# Altium schematic sheet bldc-driver.SchDoc
size A3
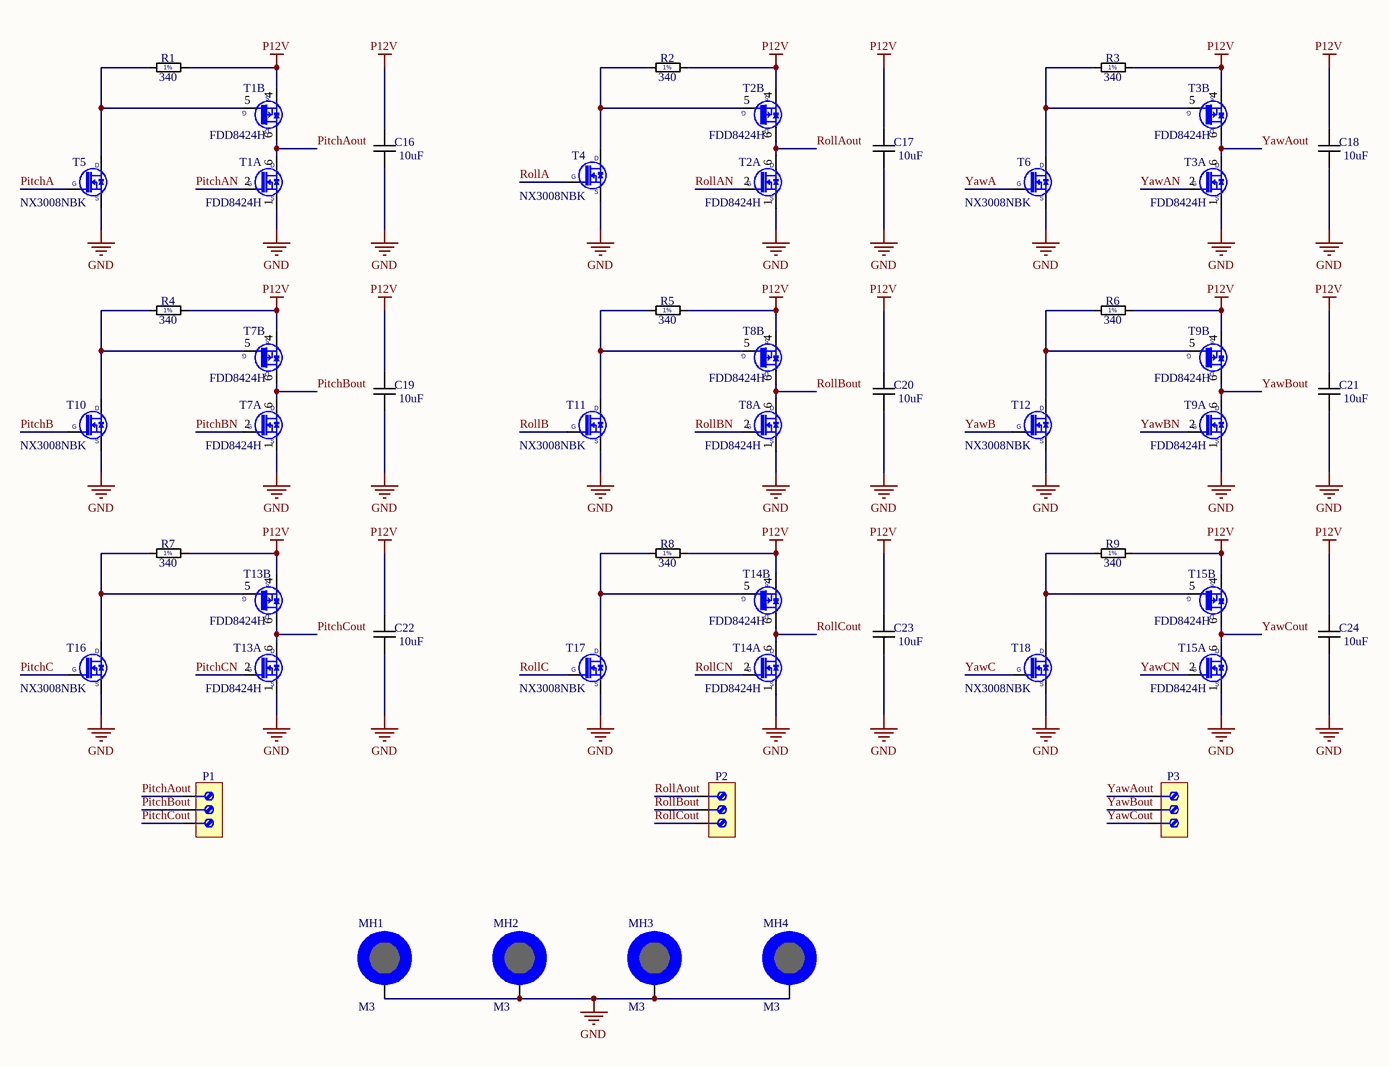
[diagram p0: bldc-driver.SchDoc]

## Parts
C16  10uF  [CAPC0603X90N]
C17  10uF  [CAPC0603X90N]
C18  10uF  [CAPC0603X90N]
C19  10uF  [CAPC0603X90N]
C20  10uF  [CAPC0603X90N]
C21  10uF  [CAPC0603X90N]
C22  10uF  [CAPC0603X90N]
C23  10uF  [CAPC0603X90N]
C24  10uF  [CAPC0603X90N]
MH1  M3  [MH-M3_COPPER]  (no BOM)
MH2  M3  [MH-M3_COPPER]  (no BOM)
MH3  M3  [MH-M3_COPPER]  (no BOM)
MH4  M3  [MH-M3_COPPER]  (no BOM)
P1  AK100/..DS-5.0-V-GREY  [SCREWERM_THT_3X1H_5P08MM]  (value not drawn)
P2  AK100/..DS-5.0-V-GREY  [SCREWERM_THT_3X1H_5P08MM]  (value not drawn)
P3  AK100/..DS-5.0-V-GREY  [SCREWERM_THT_3X1H_5P08MM]  (value not drawn)
R1  340  [RESC0402X40N]
R2  340  [RESC0402X40N]
R3  340  [RESC0402X40N]
R4  340  [RESC0402X40N]
R5  340  [RESC0402X40N]
R6  340  [RESC0402X40N]
R7  340  [RESC0402X40N]
R8  340  [RESC0402X40N]
R9  340  [RESC0402X40N]
T1  FDD8424H  [TO252 - 4L]  (parts A,B of 2)
T2  FDD8424H  [TO252 - 4L]  (parts A,B of 2)
T3  FDD8424H  [TO252 - 4L]  (parts A,B of 2)
T4  NX3008NBK  [SOT23-3]
T5  NX3008NBK  [SOT23-3]
T6  NX3008NBK  [SOT23-3]
T7  FDD8424H  [TO252 - 4L]  (parts A,B of 2)
T8  FDD8424H  [TO252 - 4L]  (parts A,B of 2)
T9  FDD8424H  [TO252 - 4L]  (parts A,B of 2)
T10  NX3008NBK  [SOT23-3]
T11  NX3008NBK  [SOT23-3]
T12  NX3008NBK  [SOT23-3]
T13  FDD8424H  [TO252 - 4L]  (parts A,B of 2)
T14  FDD8424H  [TO252 - 4L]  (parts A,B of 2)
T15  FDD8424H  [TO252 - 4L]  (parts A,B of 2)
T16  NX3008NBK  [SOT23-3]
T17  NX3008NBK  [SOT23-3]
T18  NX3008NBK  [SOT23-3]

## Nets
GND: C16.1 C17.1 C18.1 C19.1 C20.1 C21.1 C22.1 C23.1 C24.1 MH1.MH MH2.MH MH3.MH MH4.MH T1.1(S) T2.1(S) T3.1(S) T4.2(S) T5.2(S) T6.2(S) T7.1(S) T8.1(S) T9.1(S) T10.2(S) T11.2(S) T12.2(S) T13.1(S) T14.1(S) T15.1(S) T16.2(S) T17.2(S) T18.2(S)
P12V: C16.2 C17.2 C18.2 C19.2 C20.2 C21.2 C22.2 C23.2 C24.2 R1.2 R2.2 R3.2 R4.2 R5.2 R6.2 R7.2 R8.2 R9.2 T1.4(S) T2.4(S) T3.4(S) T7.4(S) T8.4(S) T9.4(S) T13.4(S) T14.4(S) T15.4(S)
PitchA: T5.1(G)
PitchAN: T1.2(G)
PitchAout: P1.1 T1.6(D)
PitchB: T10.1(G)
PitchBN: T7.2(G)
PitchBout: P1.2 T7.6(D)
PitchC: T16.1(G)
PitchCN: T13.2(G)
PitchCout: P1.3 T13.6(D)
RollA: T4.1(G)
RollAN: T2.2(G)
RollAout: P2.1 T2.6(D)
RollB: T11.1(G)
RollBN: T8.2(G)
RollBout: P2.2 T8.6(D)
RollC: T17.1(G)
RollCN: T14.2(G)
RollCout: P2.3 T14.6(D)
YawA: T6.1(G)
YawAN: T3.2(G)
YawAout: P3.1 T3.6(D)
YawB: T12.1(G)
YawBN: T9.2(G)
YawBout: P3.2 T9.6(D)
YawC: T18.1(G)
YawCN: T15.2(G)
YawCout: P3.3 T15.6(D)
NetR1_1: R1.1 T1.5(G) T5.3(D)
NetR2_1: R2.1 T2.5(G) T4.3(D)
NetR3_1: R3.1 T3.5(G) T6.3(D)
NetR4_1: R4.1 T7.5(G) T10.3(D)
NetR5_1: R5.1 T8.5(G) T11.3(D)
NetR6_1: R6.1 T9.5(G) T12.3(D)
NetR7_1: R7.1 T13.5(G) T16.3(D)
NetR8_1: R8.1 T14.5(G) T17.3(D)
NetR9_1: R9.1 T15.5(G) T18.3(D)

## Library data of the parts
C16-C24 = CC0603_10UF_16V_20%_X5R: Non-polarised capacitor; Manufacturer: GENERIC; Manufacturer 1 Example: Samsung; Manufacturer 1 Part Number: CL10A106MO8NQNC; Manufacturer 1 Component Height: 0.8mm; PressFit: No; Dielectric: X5R; Tolerance: 20%; Voltage: 16V; DesignItemId: CC0603_10UF_16V_20%_X5R; Author: KB; Case: 0603 (1608 metric); Component Kind: Standard; HelpURL: https://www.vishay.com/docs/28548/vjw1bcbascomseries.pdf; Manufacturer Part Number: CC0603_10UF_16V_20%_X5R; Mounted: Yes; Part Description: Non-polarised capacitor; Pin Count: 2; Sense: No; SMD: Yes; Socket: No; Status: Recommended; Value: 10uF; Supplier 1: Farnell; Supplier 2: TME; Supplier 3: Mouser; Create Date: 01.04.2019; LatestRevisionDate: 01.04.2019; Supplier Part Number 1: 2611923; Supplier Part Number 2: CL10A106MO8NQNC; Supplier Part Number 3: 81-GRM188R61C106KALD
MH1-MH4 = MH-M3_C: Mounting hole, M3, exposed pad; DesignItemId: MH-M3_C; Author: KB; Family: M3; Part Description: Mounting hole, M3, exposed pad; Create Date: 19.05.2011; LatestRevisionDate: 19.05.2011
P1-P3 = SCREWERM_THT_3X1H_5P08MM: Terminal Block, Right angle, 3 Positions, THT, Screw Connection, 15x9mm body; Manufacturer: GENERIC; Manufacturer Part Number: SCREWTERM_THT_3X1H_5P08MM; Manufacturer 1 Example: PTR Messtechnik; Manufacturer 1 Part Number: AK100/3DS-5,0-V/GRAU; Manufacturer 1 Component Height: 12.5mm; Current Max: 24A; PressFit: No; Voltage Max: 250V; DesignItemId: SCREWERM_THT_3X1H_5P08MM; Author: KB; Family: AK100/..DS-5.0-V-GREY; Component Kind: Standard; Footprint: SCREWTERM_THT_3X1H_5P08MM; HelpURL: https://www.ptr.eu/en/products/connection-technology/terminal-blocks-screw-terminal-blocks/ak100ds-50-v-grey/; Mounted: Yes; Part Description: Terminal Block, Right angle, 3 Positions, THT, Screw Connection, 15x9mm body; Pin Count: 3; Sense: No; SMD: No; Socket: No; Status: Recommended; Supplier 1: TME; Supplier 2: Farnell; Create Date: 19.03.2012; LatestRevisionDate: 19.03.2012; Supplier Part Number 1: TB-5.0-P-3P-12; Supplier Part Number 2: 1131856
R1-R9 = R0402_340R_0.0625W_100PPM: General Purpose Thick Film Chip Resistor; Manufacturer: GENERIC; Manufacturer Part Number: R0402_340R_0.0625W 0.1W 0.125W 0.25W 0.5W 1W 0.75W 1W_100PPM; Manufacturer 1 Example: Vishay; Manufacturer 1 Part Number: CRCW0402340RFKEDC; Manufacturer 1 Component Height: 0.4mm; Power: 62.5mW; Current Max: 0; PressFit: No; TC: ?100 ppm/?C; Tolerance: 1%; Voltage: 50V; DesignItemId: R0402_340R_0.0625W_100PPM; Author: KB; Case: 0402 (1005 metric); Component Kind: Standard; Component Type: Standard; HelpURL: https://www.vishay.com/docs/20035/dcrcwe3.pdf; Mounted: Yes; Part Description: General Purpose Thick Film Chip Resistor; Pin Count: 2; Sense: No; SMD: Yes; Socket: No; Status: Recommended; Value: 340; Supplier 1: Farnell; Supplier 2: TME; Supplier 3: Mouser; Create Date: 03.07.2019; LatestRevisionDate: 03.07.2019
T1-T3 T7-T9 T13-T15 = FDD8424H: Dual N & P-Channel PowerTreanch MOSFET, N-Channel: 40V, 20A, 24 mOhm, P-Channel: -40, -20A, 54 mOhm; Manufacturer 1 Example: ON Semiconductor; Manufacturer 1 Component Height: 2.39mm; PressFit: No; DesignItemId: FDD8424H; Author: PC; Device: FDD8424H; Component Kind: Standard; Footprint: TO252-4L; HelpURL: https://www.tme.eu/Document/38dda53118835eeff1a13f08274202e9/FDD8424H.pdf; Mounted: Yes; Part Description: Dual N & P-Channel PowerTreanch MOSFET, N-Channel: 40V, 20A, 24 mOhm, P-Channel: -40, -20A, 54 mOhm; Pin Count: 5; Sense: No; SMD: Yes; Socket: No; Supplier 1: TME; Supplier 2: Mouser; Supplier 3: Farnell; Create Date: 14.01.2019; LatestRevisionDate: 14.01.2019; Supplier Part Number 1: FDD8424H; Supplier Part Number 3: 1498953RL
T4-T6 T10-T12 T16-T18 = NX3008NBK: 30 V, 400 mA N-channel Trench MOSFET; Manufacturer 1 Example: Nexperia; Manufacturer 1 Component Height: 1.05mm; Part Description: N-MOS FET Transistor, 30 V, 400 mA, 350mW, SOT32; PressFit: No; DesignItemId: NX3008NBK; Author: PC; Device: NX3008NBK; Component Kind: Standard; HelpURL: https://www.tme.eu/Document/2a8ab25ae7d47621570cad3709a4895f/NX3008NBK.pdf; Manufacturer 1 Part Number: NX3008NBK; Mounted: Yes; Pin Count: 3; Sense: No; SMD: Yes; Socket: No; Supplier 1: TME; Supplier 2: Farnell; Supplier 3: Mouser; Create Date: 19.07.2029; LatestRevisionDate: 19.07.2029; Supplier Part Number 1: NX3008NBK.215; Supplier Part Number 2: 2069541; Supplier Part Number 3: 771-NX3008NBK,215